# EAGLE design praktikum_set (EAGLE 9.6.2)
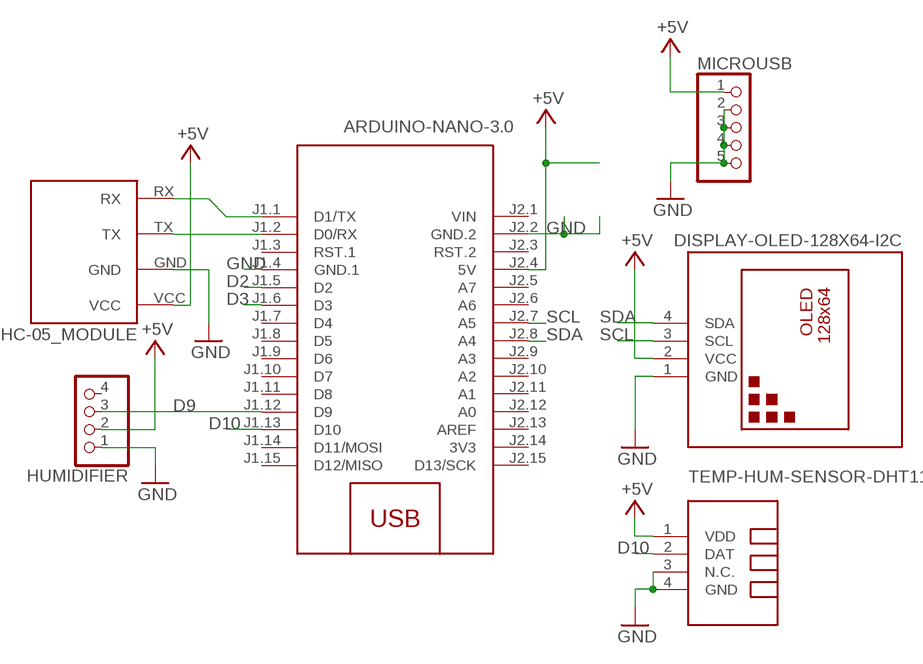
[diagram p0: schematic, sheet 1]

## Parts
DHT11  TEMP-HUM-SENSOR-DHT11  [TEMP-HUM-SENSOR-DHT11]
HC-05_MODULE  BLUETOOTH_BOARDSTANDING  [BT_BOARD_FOOTPRINT_STANDING]
HUMIDIFIER  PINHD-1X4  [1X04]
M1  ARDUINO-NANO-3.0  [ARDUINO-NANO-3.0]
MICROUSB  PINHD-1X5  [1X05]
U$1  DISPLAY-OLED-128X64-I2C  [DISPLAY-OLED-128X64-I2C]

## Nets
+5V: DHT11.1(VDD) HC-05_MODULE.VCC HUMIDIFIER.2 M1.J2.4(5V) MICROUSB.1 U$1.2(VCC)
D2: M1.J1.5(D2)
D3: M1.J1.6(D3)
D9: HUMIDIFIER.3 M1.J1.12(D9)
D10: DHT11.2(DAT) M1.J1.13(D10)
GND: DHT11.3(N.C.) DHT11.4(GND) HC-05_MODULE.GND HUMIDIFIER.1 M1.J1.4(GND.1) M1.J2.2(GND.2) MICROUSB.2 MICROUSB.3 MICROUSB.4 MICROUSB.5 U$1.1(GND)
N$1: HC-05_MODULE.RX M1.J1.1(D1/TX)
N$2: HC-05_MODULE.TX M1.J1.2(D0/RX)
SCL: M1.J2.7(A5) U$1.3(SCL)
SDA: M1.J2.8(A4) U$1.4(SDA)
Unconnected: HUMIDIFIER.4 M1.J1.3(RST.1) M1.J1.7(D4) M1.J1.8(D5) M1.J1.9(D6) M1.J1.10(D7) M1.J1.11(D8) M1.J1.14(D11/MOSI) M1.J1.15(D12/MISO) M1.J2.3(RST.2) M1.J2.5(A7) M1.J2.6(A6) M1.J2.9(A3) M1.J2.10(A2) M1.J2.11(A1) M1.J2.12(A0) M1.J2.13(AREF) M1.J2.15(D13/SCK)

## Power pins joined to a net without a drawn wire
3V3: M1.J2.14(3V3)
VIN: M1.J2.1(VIN)

## Library data of the parts
DHT11 = diy-modules:TEMP-HUM-SENSOR-DHT11: DHT11 - digital humidity & temperature sensor DHT11 datasheet available here: https://akizukidenshi.com/download/ds/aosong/DHT11.pdf Click here to find device on ebay.com <http://www.ebay.com/sch/dht11+digital+sensor>
HC-05_MODULE = hc-05:BLUETOOTH_BOARD: Bluetooth Board V1.05
HUMIDIFIER = pinhead:PINHD-1X4: PIN HEADER
M1 = diy-modules:ARDUINO-NANO-3.0: Arduino Nano 3.0 and compatible devices More details available here: https://www.arduino.cc/en/Main/ArduinoBoardNano Click here to find device on ebay.com <http://www.ebay.com/sch/arduino+nano>
MICROUSB = pinhead:PINHD-1X5: PIN HEADER
U$1 = diy-modules:DISPLAY-OLED-128X64-I2C: 128x64 Dot Matrix OLED Module based on SSD1306 chip Variant with I2C interface More details available here: http://www.instructables.com/id/Monochrome-096-i2c-OLED-display-with-arduino-SSD13/ SSD1306 datasheet: https://cdn-shop.adafruit.com/datasheets/SSD1306.pdf Click here to find device on ebay.com <http://www.ebay.com/sch/oled+display+128x64+iic> Note: There are two variants: I2C and SPI. Search for the proper version.

## Net classes
0 default: width 0.559 mm, clearance 0.66 mm

## Board
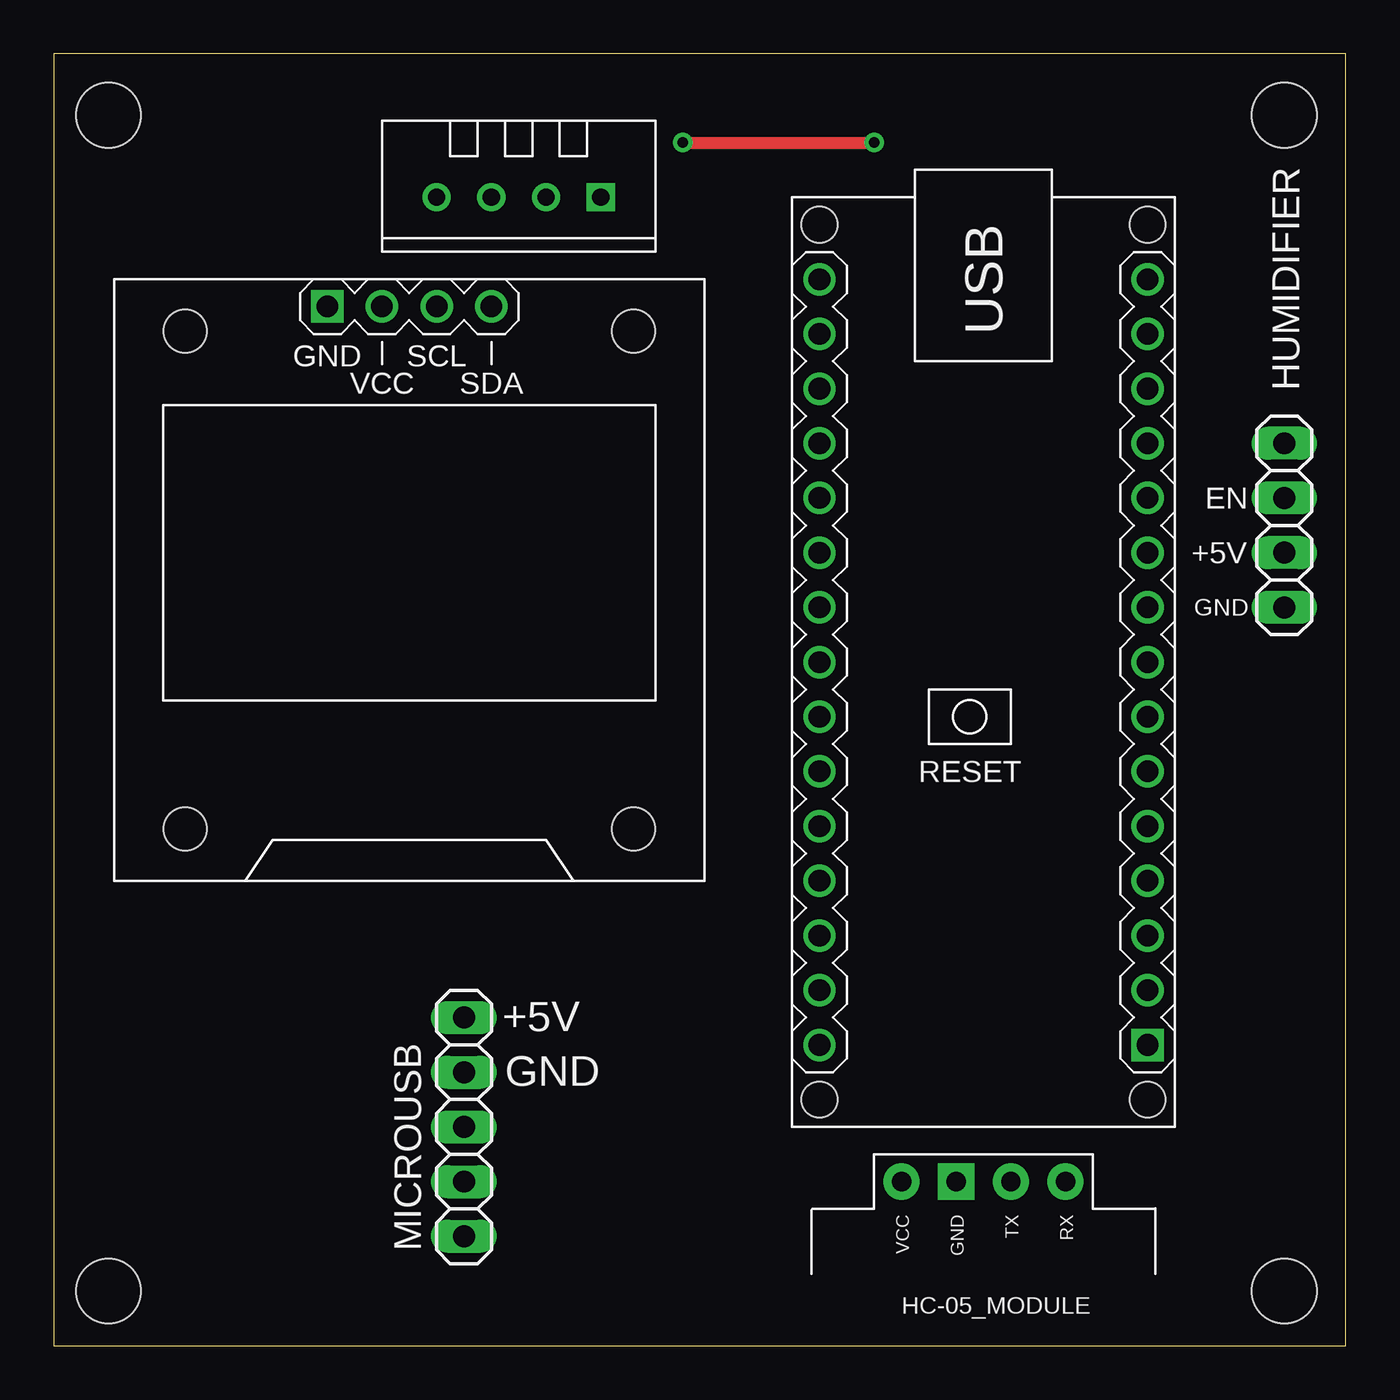
[diagram p1: board, top side]
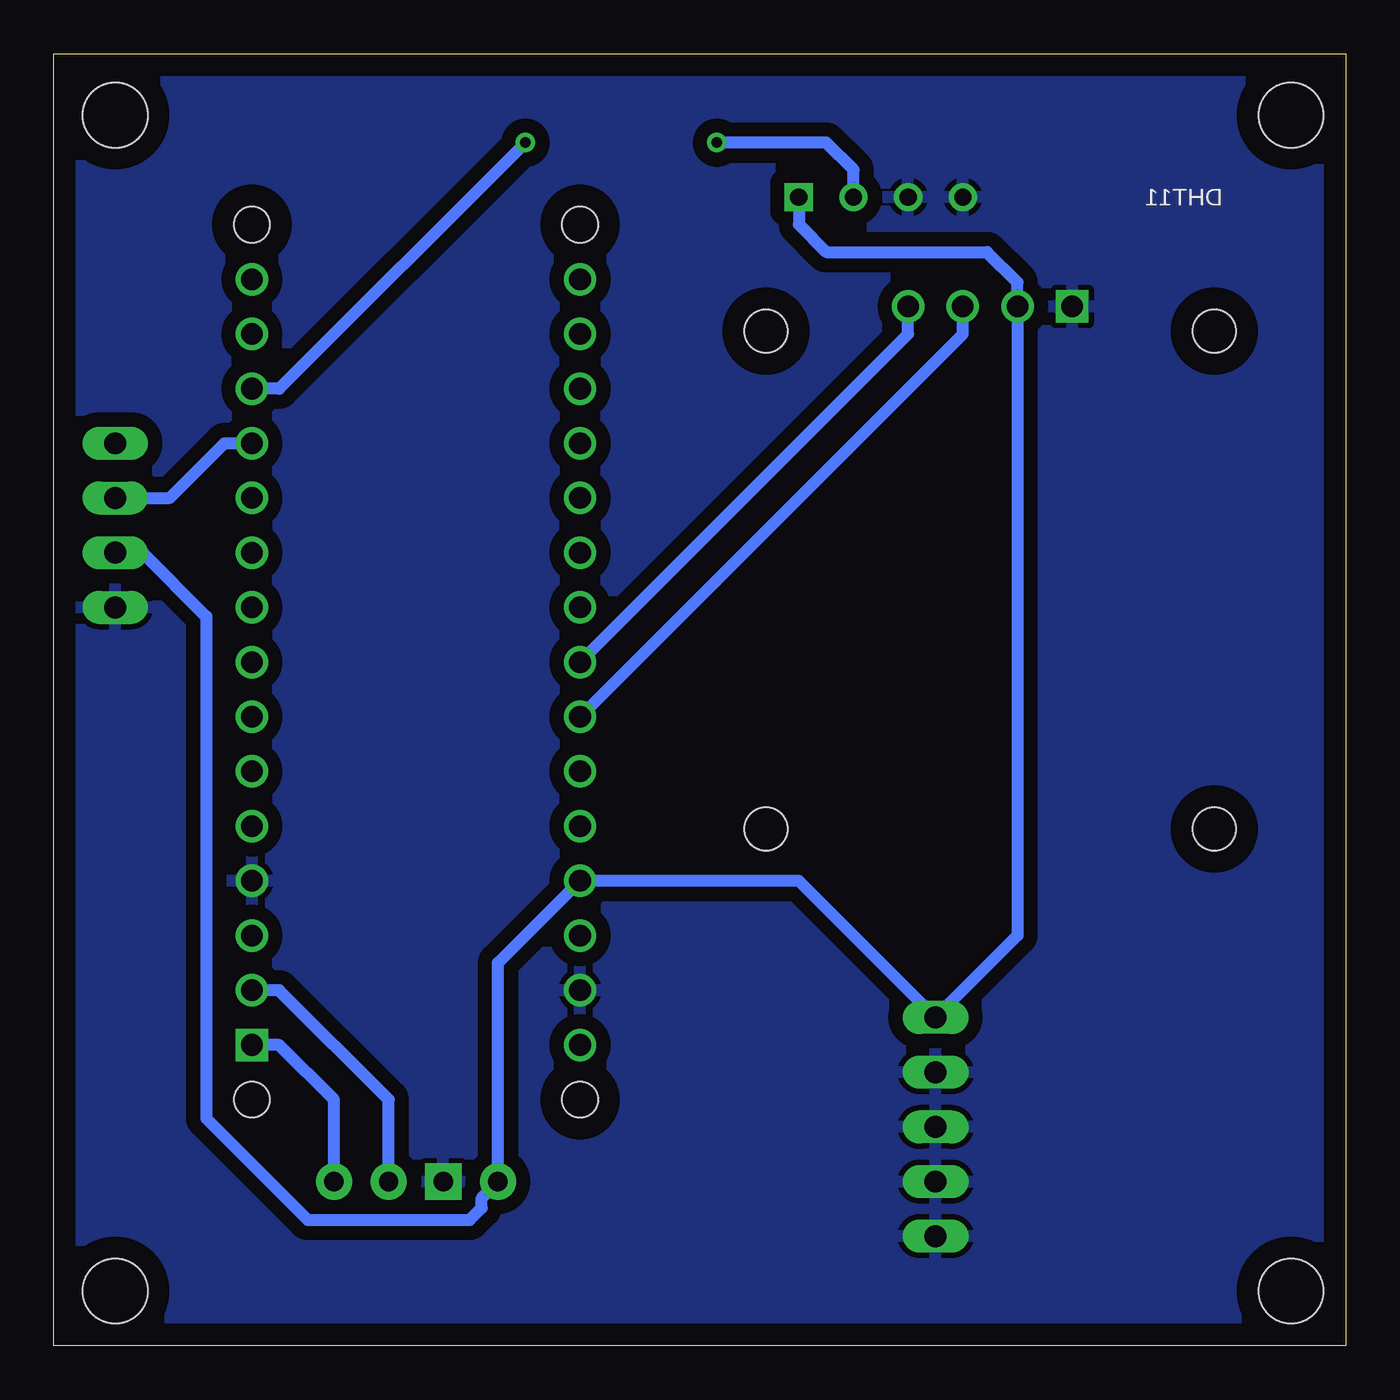
[diagram p2: board, bottom side, seen from below]

Size 60 x 60 mm. Coordinates in mm from the lower left corner, seen from the top.
Outline: 0,0 60,0 60,60 0,60 0,0
Copper layers (1*16): Top 0.035mm / dielectric 1.5mm / Bottom 0.035mm
Design rules "default": minimum track width 6mil, minimum drill 0.35mm, track to track 6mil, track to pad 6mil, pad to pad 6mil, via to via 6mil, smd to smd 6mil, copper to edge 40mil, drill to drill 6mil, minimum pad ring 10mil, minimum via ring 8mil, stop-mask expansion 4mil, vias tented up to drill 0mil, thermal gap 10mil
Holes 3 mm at 57.15,2.54 2.54,2.54 2.54,57.15 57.15,57.15

### Footprints (pad centres in the part's own frame; a part is rotated, then mirrored left to right if it is on the bottom)
TEMP-HUM-SENSOR-DHT11 = drill 0.8 square: 1 -3.81,0 | drill 0.8: 2 -1.27,0; 3 1.27,0; 4 3.81,0
BT_BOARD_FOOTPRINT_STANDING = drill 0.9 pad 1.676 square: GND -3.81,-1.27 | drill 0.9 pad 1.676: RX -3.81,3.81; TX -3.81,1.27; VCC -3.81,-3.81
1X04 = drill 1.016 long: 1 -3.81,0; 2 -1.27,0; 3 1.27,0; 4 3.81,0
ARDUINO-NANO-3.0 = drill 1 square: J1.1 17.78,7.62 | drill 1: J1.2 15.24,7.62; J1.3 12.7,7.62; J1.4 10.16,7.62; J1.5 7.62,7.62; J1.6 5.08,7.62; J1.7 2.54,7.62; J1.8 0,7.62; J1.9 -2.54,7.62; J1.10 -5.08,7.62; J1.11 -7.62,7.62; J1.12 -10.16,7.62; J1.13 -12.7,7.62; J1.14 -15.24,7.62; J1.15 -17.78,7.62; J2.1 17.78,-7.62; J2.2 15.24,-7.62; J2.3 12.7,-7.62; J2.4 10.16,-7.62; J2.5 7.62,-7.62; J2.6 5.08,-7.62; J2.7 2.54,-7.62; J2.8 0,-7.62; J2.9 -2.54,-7.62; J2.10 -5.08,-7.62; J2.11 -7.62,-7.62; J2.12 -10.16,-7.62; J2.13 -12.7,-7.62; J2.14 -15.24,-7.62; J2.15 -17.78,-7.62 | hole 1.651: -20.32,7.62; -20.32,-7.62; 20.32,-7.62; 20.32,7.62
1X05 = drill 1.016 long: 1 -5.08,0; 2 -2.54,0; 3 0,0; 4 2.54,0; 5 5.08,0
DISPLAY-OLED-128X64-I2C = drill 1 square: 1 -3.81,12.7 | drill 1: 2 -1.27,12.7; 3 1.27,12.7; 4 3.81,12.7 | hole 2: -10.414,11.557; 10.414,11.557; 10.414,-11.557; -10.414,-11.557

### Placement (x,y rotation side)
DHT11  21.59,53.34 180 top
HC-05_MODULE  43.18,3.81 270 top
HUMIDIFIER  57.15,38.1 90 top
M1  43.18,31.75 270 top
MICROUSB  19.05,10.16 270 top
U$1  16.51,35.56 0 top

### Tracks (layer width: path | path; a pad name or v marks a point on that pad's centre or on a via)
+5V
  Bottom 0.559: 38.95,8.04 HC-05_MODULE.VCC | HUMIDIFIER.2 55.88,36.83 52.92,33.87 52.92,10.55 48.21,5.84 40.68,5.84 40.13,6.39 40.13,6.86 HC-05_MODULE.VCC | DHT11.1 25.4,52.07 24.13,50.8 16.66,50.8 15.24,49.38 U$1.2 15.24,19.05 MICROUSB.1 25.4,21.59 M1.J2.4 39.37,17.78 HC-05_MODULE.VCC
D9
  Bottom 0.559: HUMIDIFIER.3 54.61,39.37 52.07,41.91 M1.J1.12
D10  (via drill 0.5)
  Top 0.559: v29.21,55.88 v38.1,55.88
  Bottom 0.559: M1.J1.13 49.53,44.45 v38.1,55.88 | DHT11.2 22.86,54.61 24.13,55.88 v29.21,55.88
GND
  pour Bottom: 0,0 59.69,0 59.69,59.69 0,59.69
N$1
  Bottom 0.559: M1.J1.1 49.53,13.97 46.99,11.43 HC-05_MODULE.RX
N$2
  Bottom 0.559: M1.J1.2 49.53,16.51 44.45,11.43 HC-05_MODULE.TX
SCL
  Bottom 0.559: M1.J2.7 17.78,46.99 U$1.3
SDA
  Bottom 0.559: M1.J2.8 20.32,46.99 U$1.4

### Text on the board
tPlace: EN | +5V | GND | +5V | GND
bPlace: DHT11